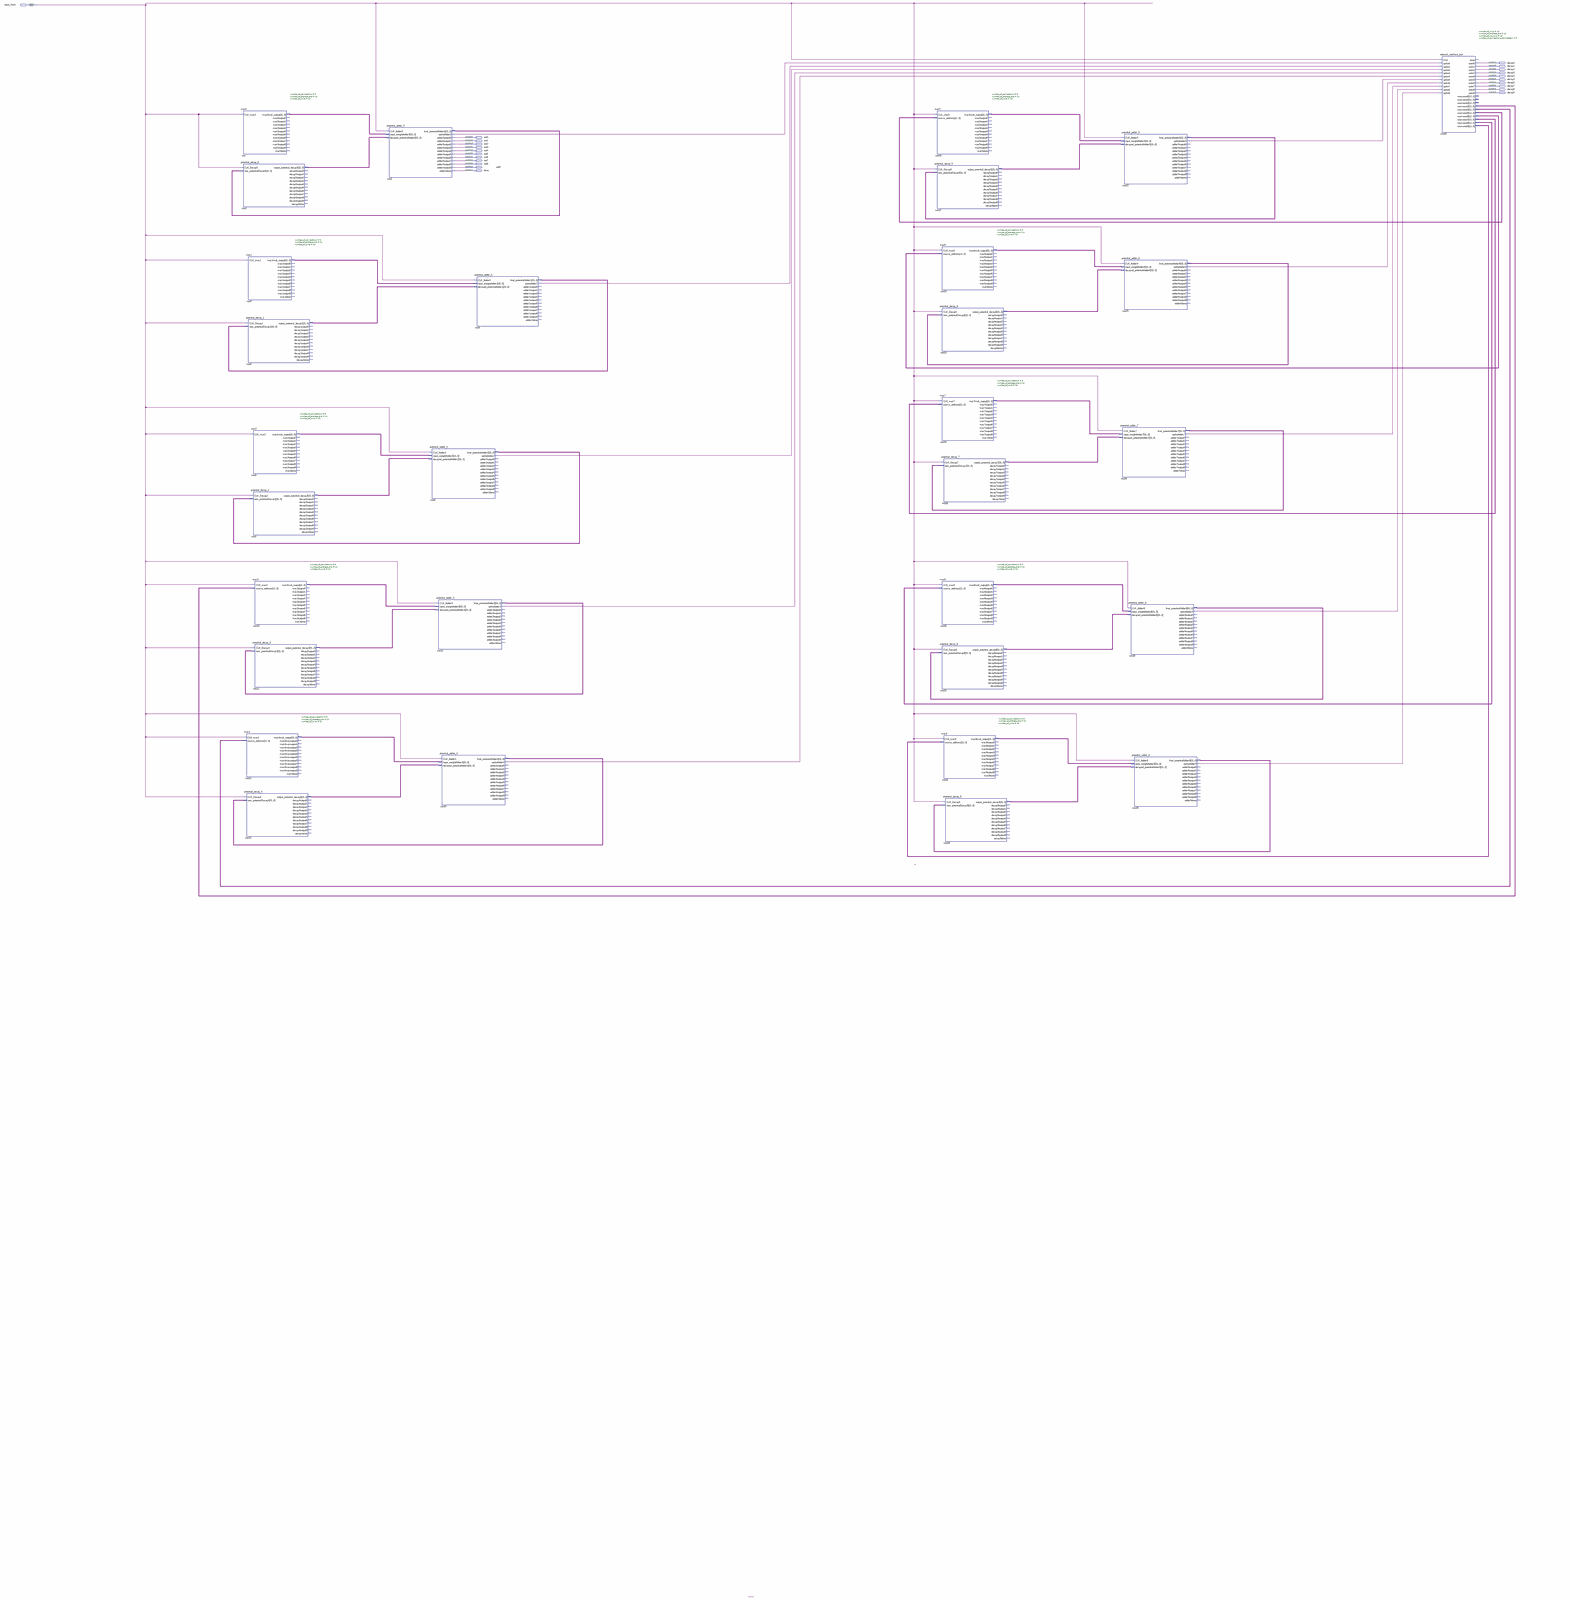
[diagram p0: schematic sheet, whole]
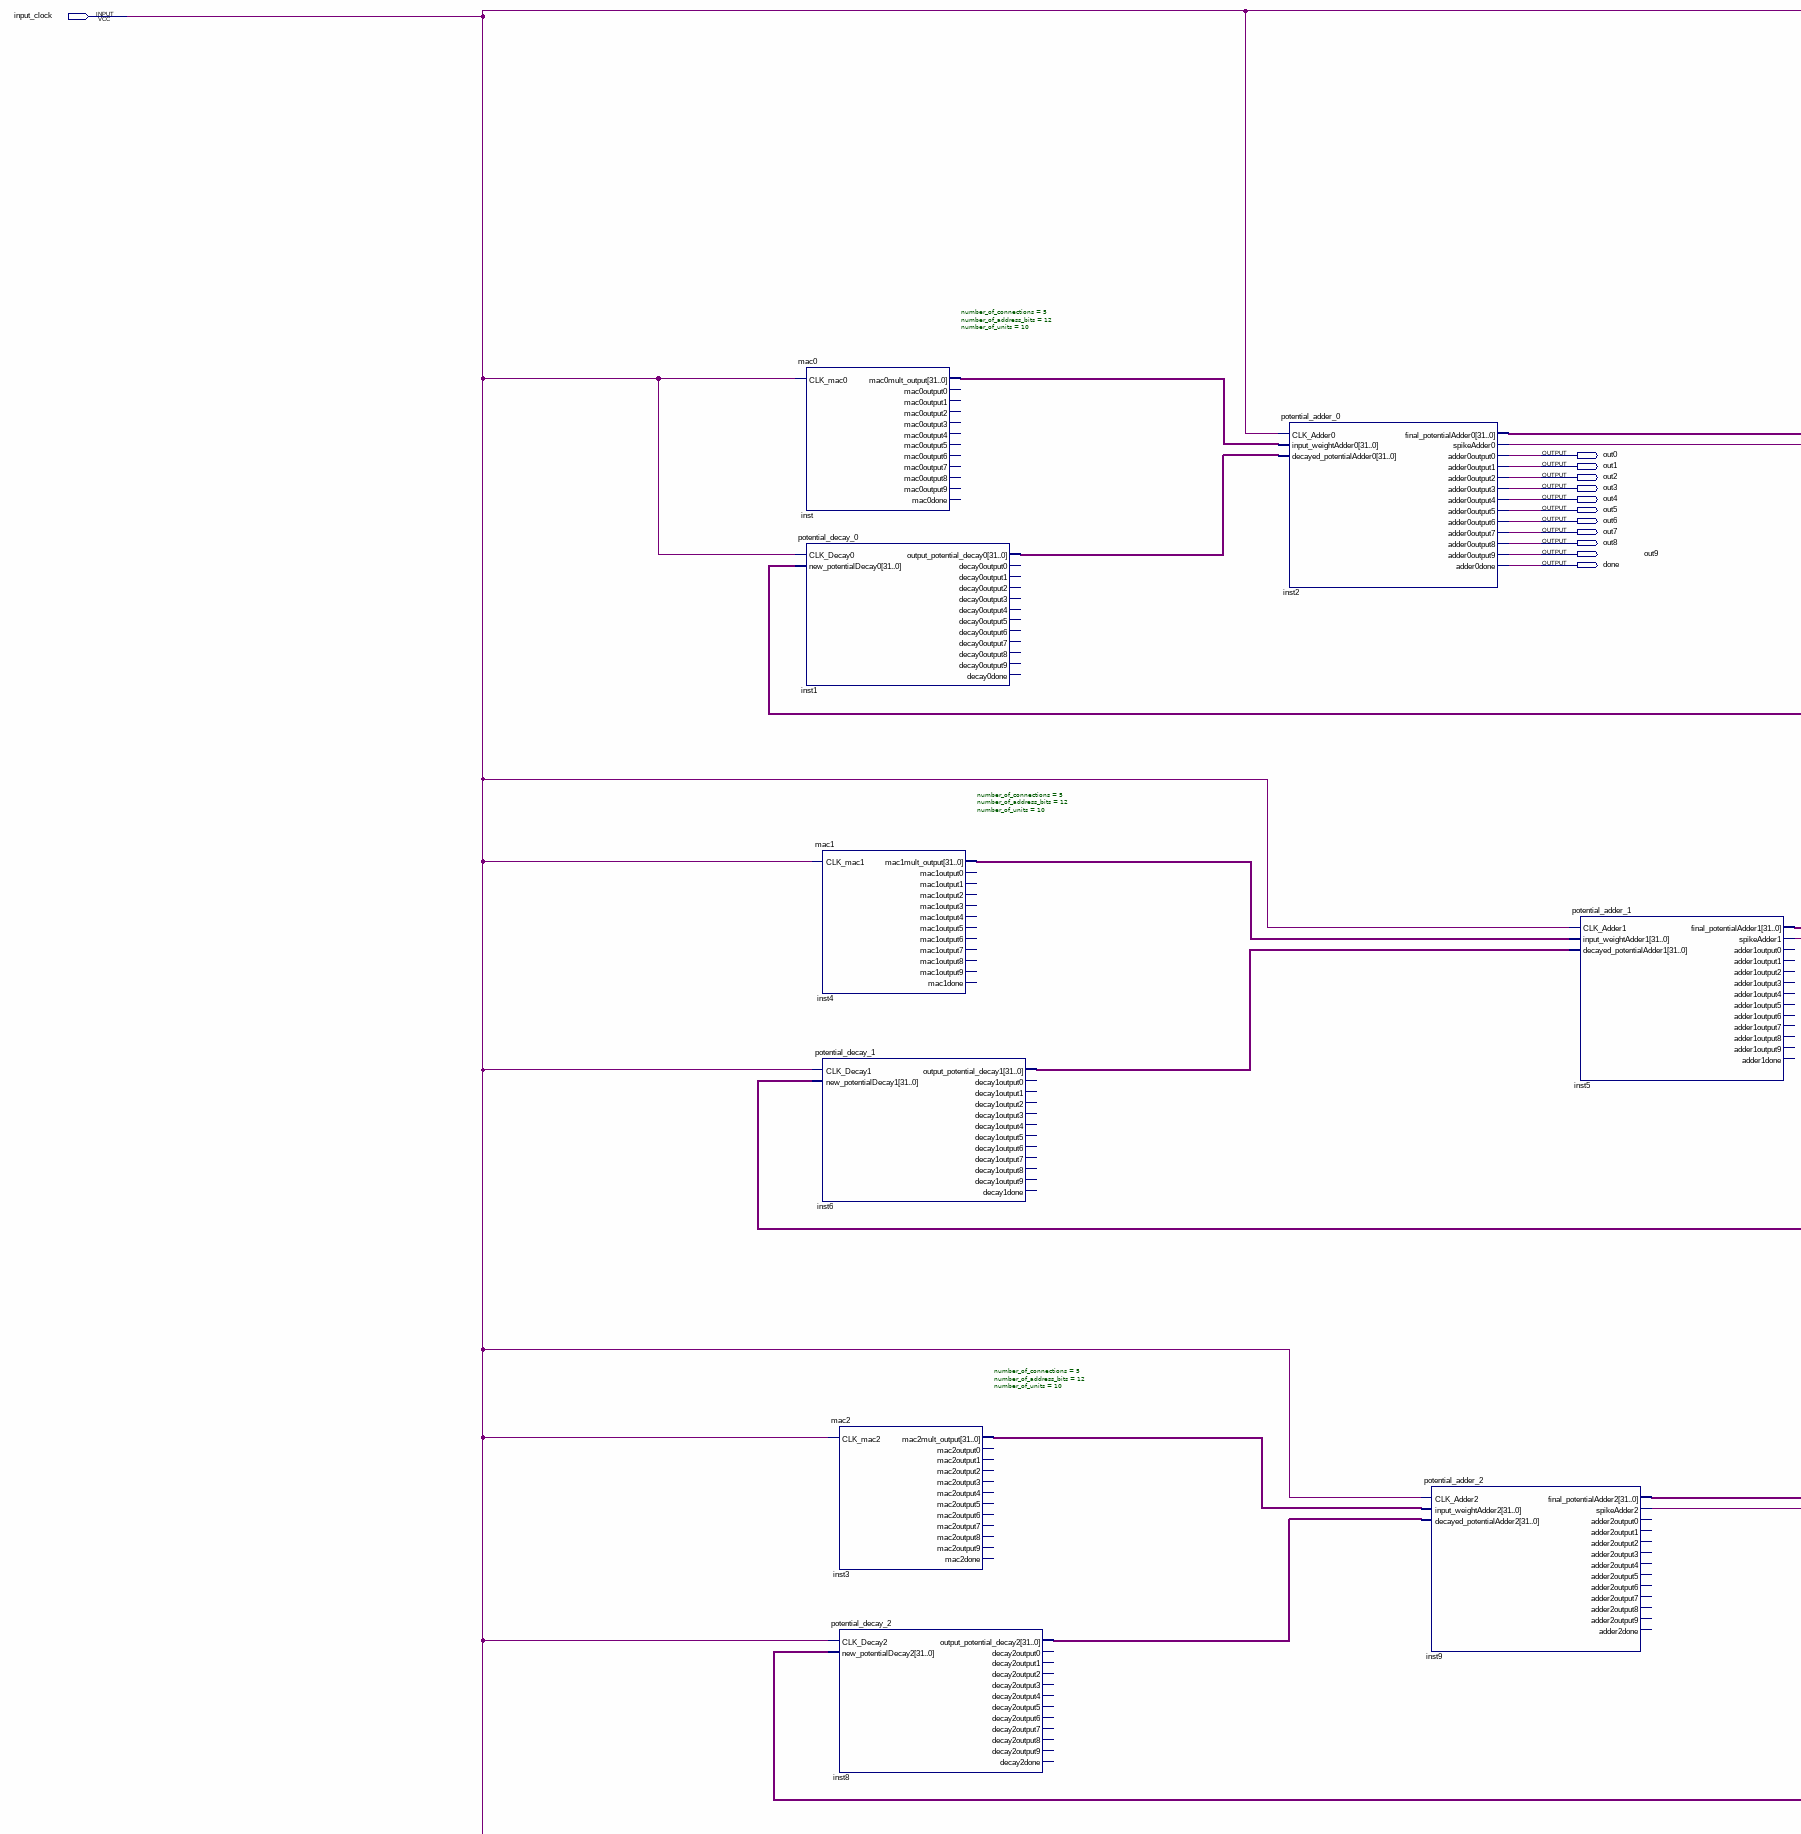
[diagram p1: schematic sheet, upper left part]
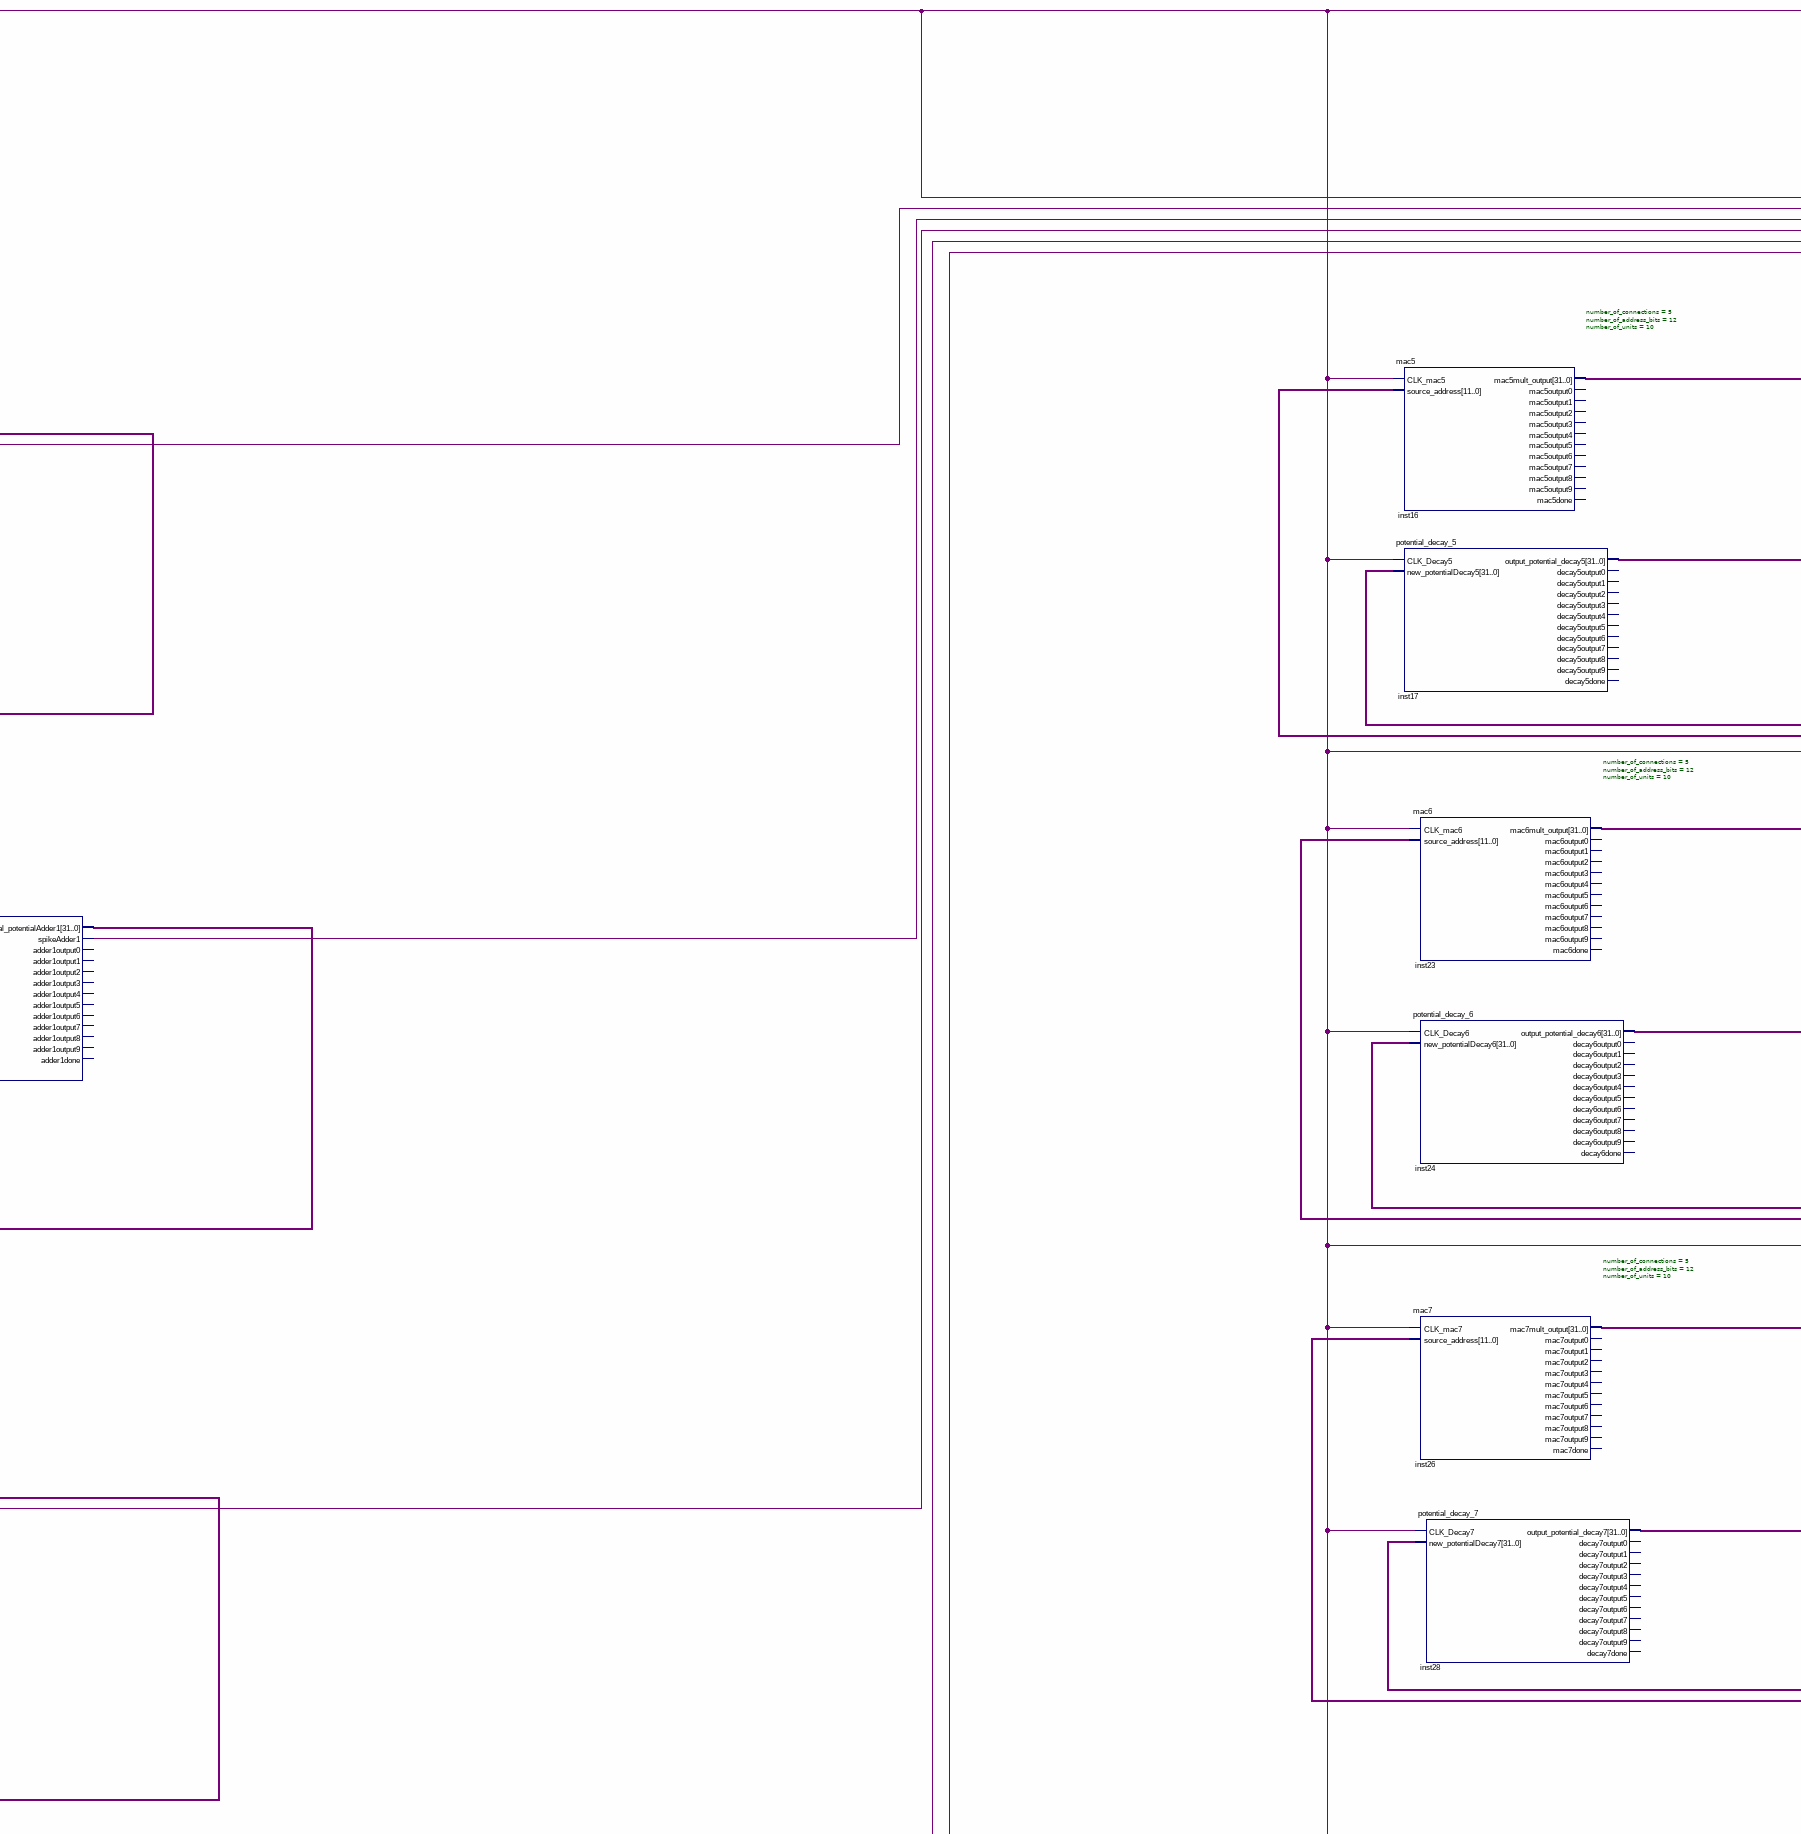
[diagram p2: schematic sheet, upper centre part]
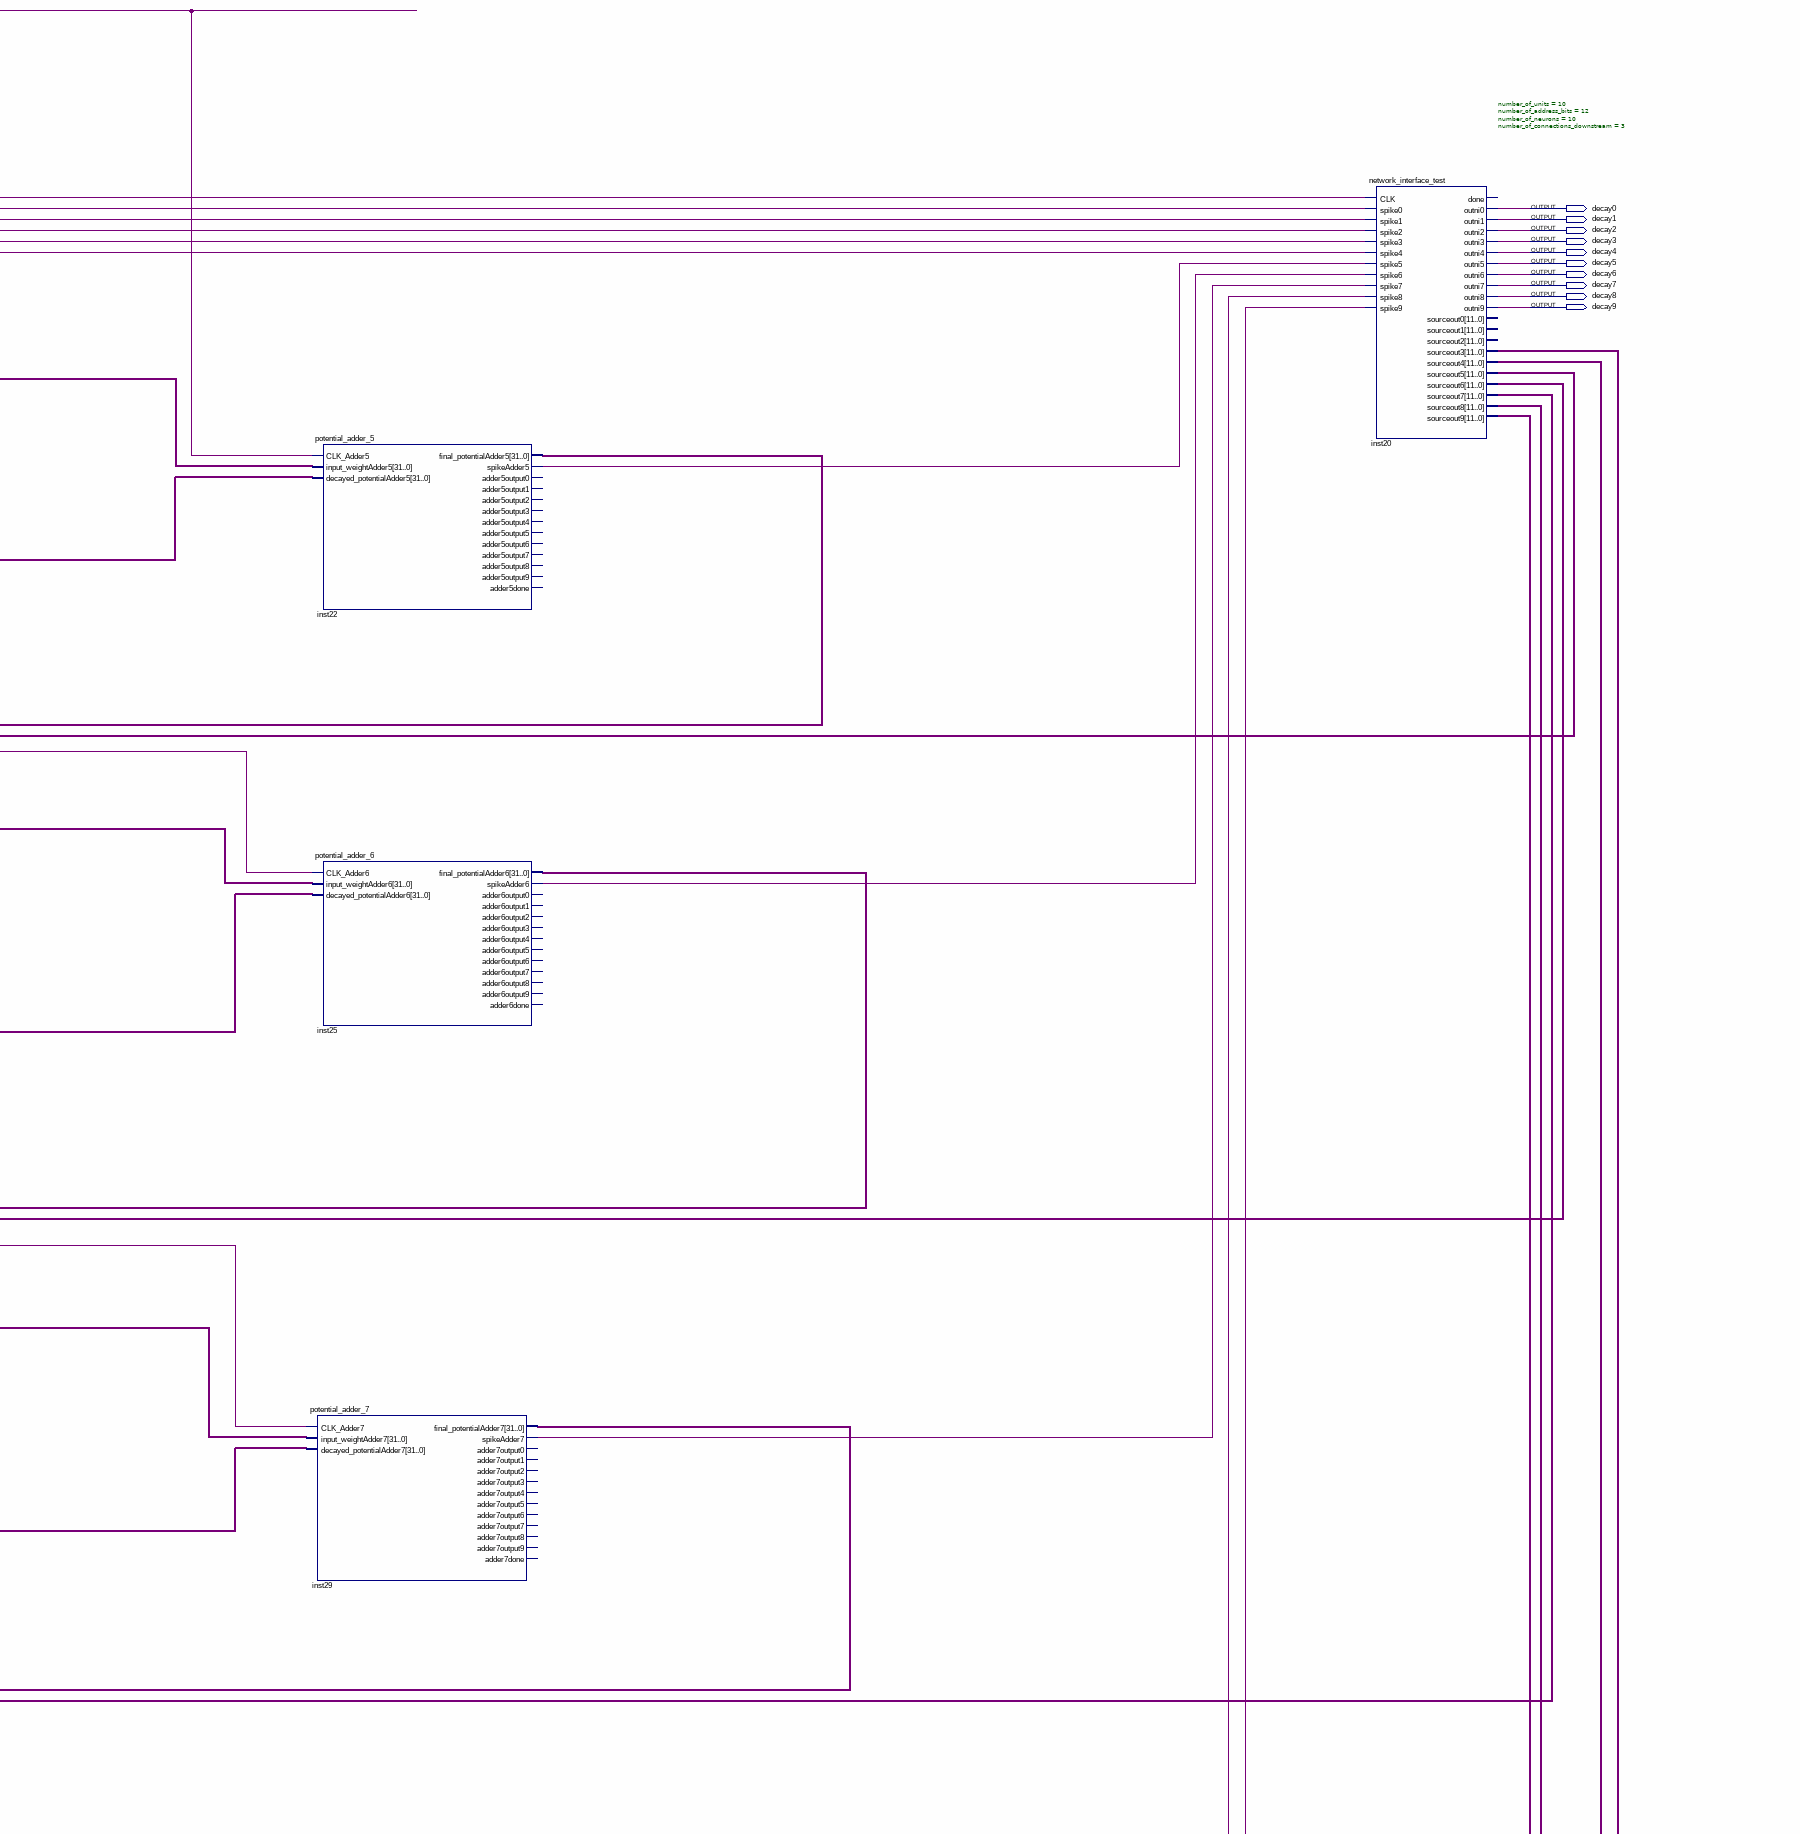
[diagram p3: schematic sheet, upper right part]
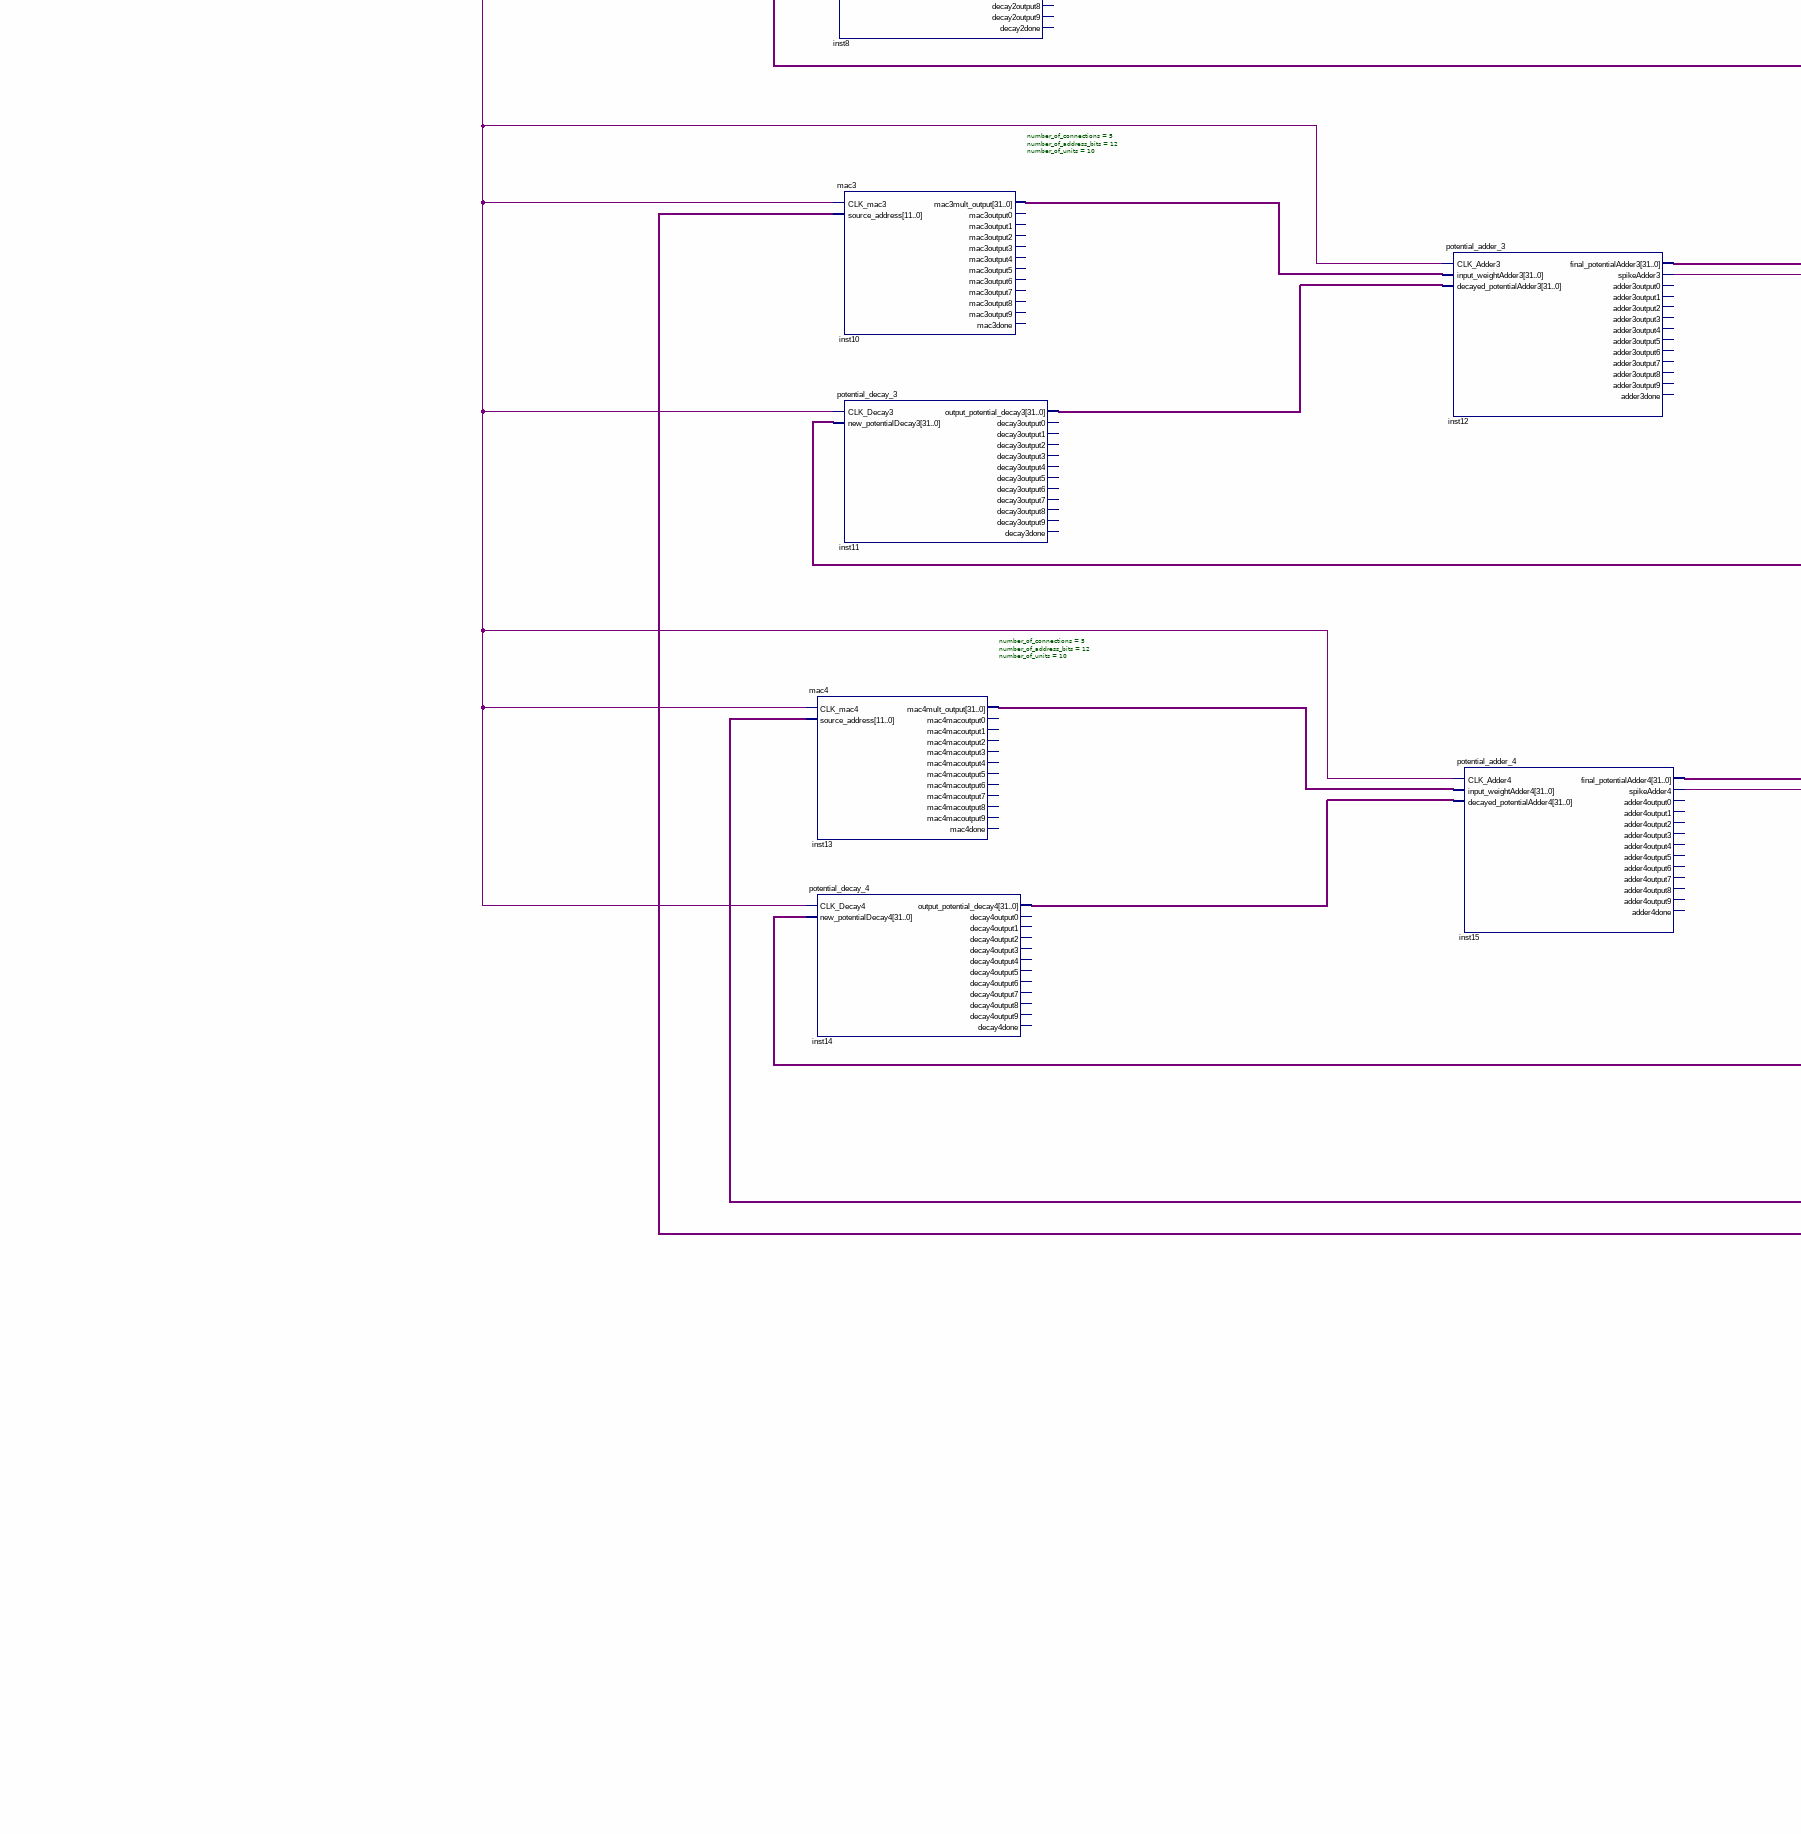
[diagram p4: schematic sheet, middle left part]
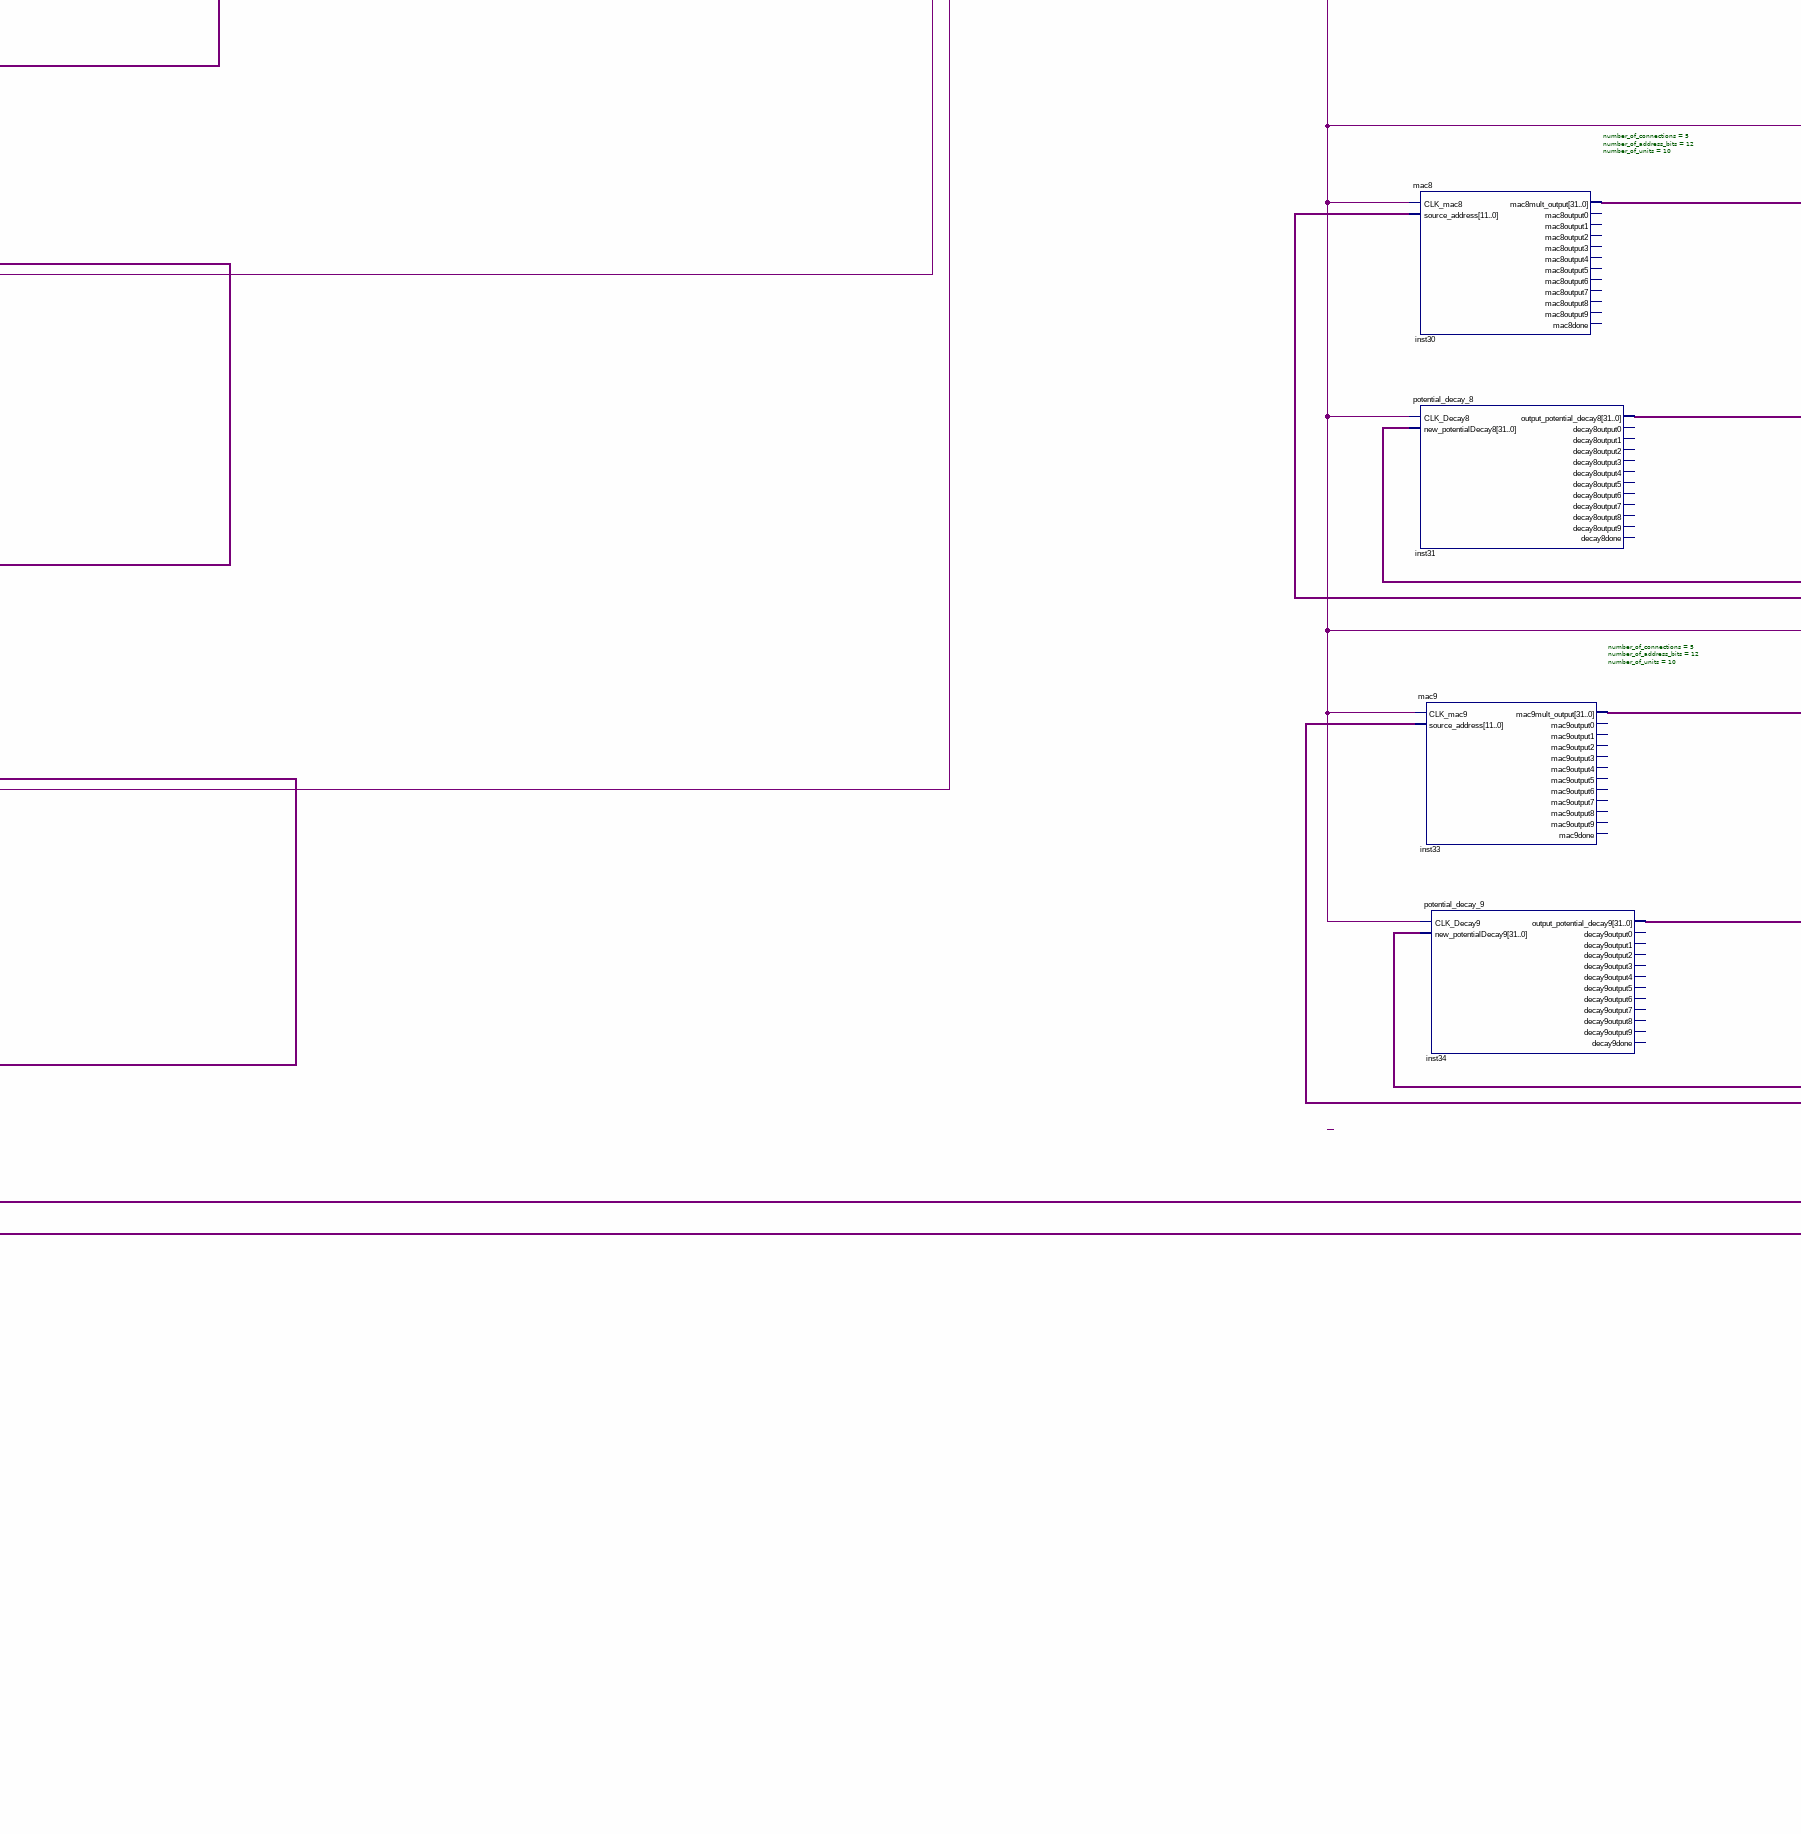
[diagram p5: schematic sheet, middle centre part]
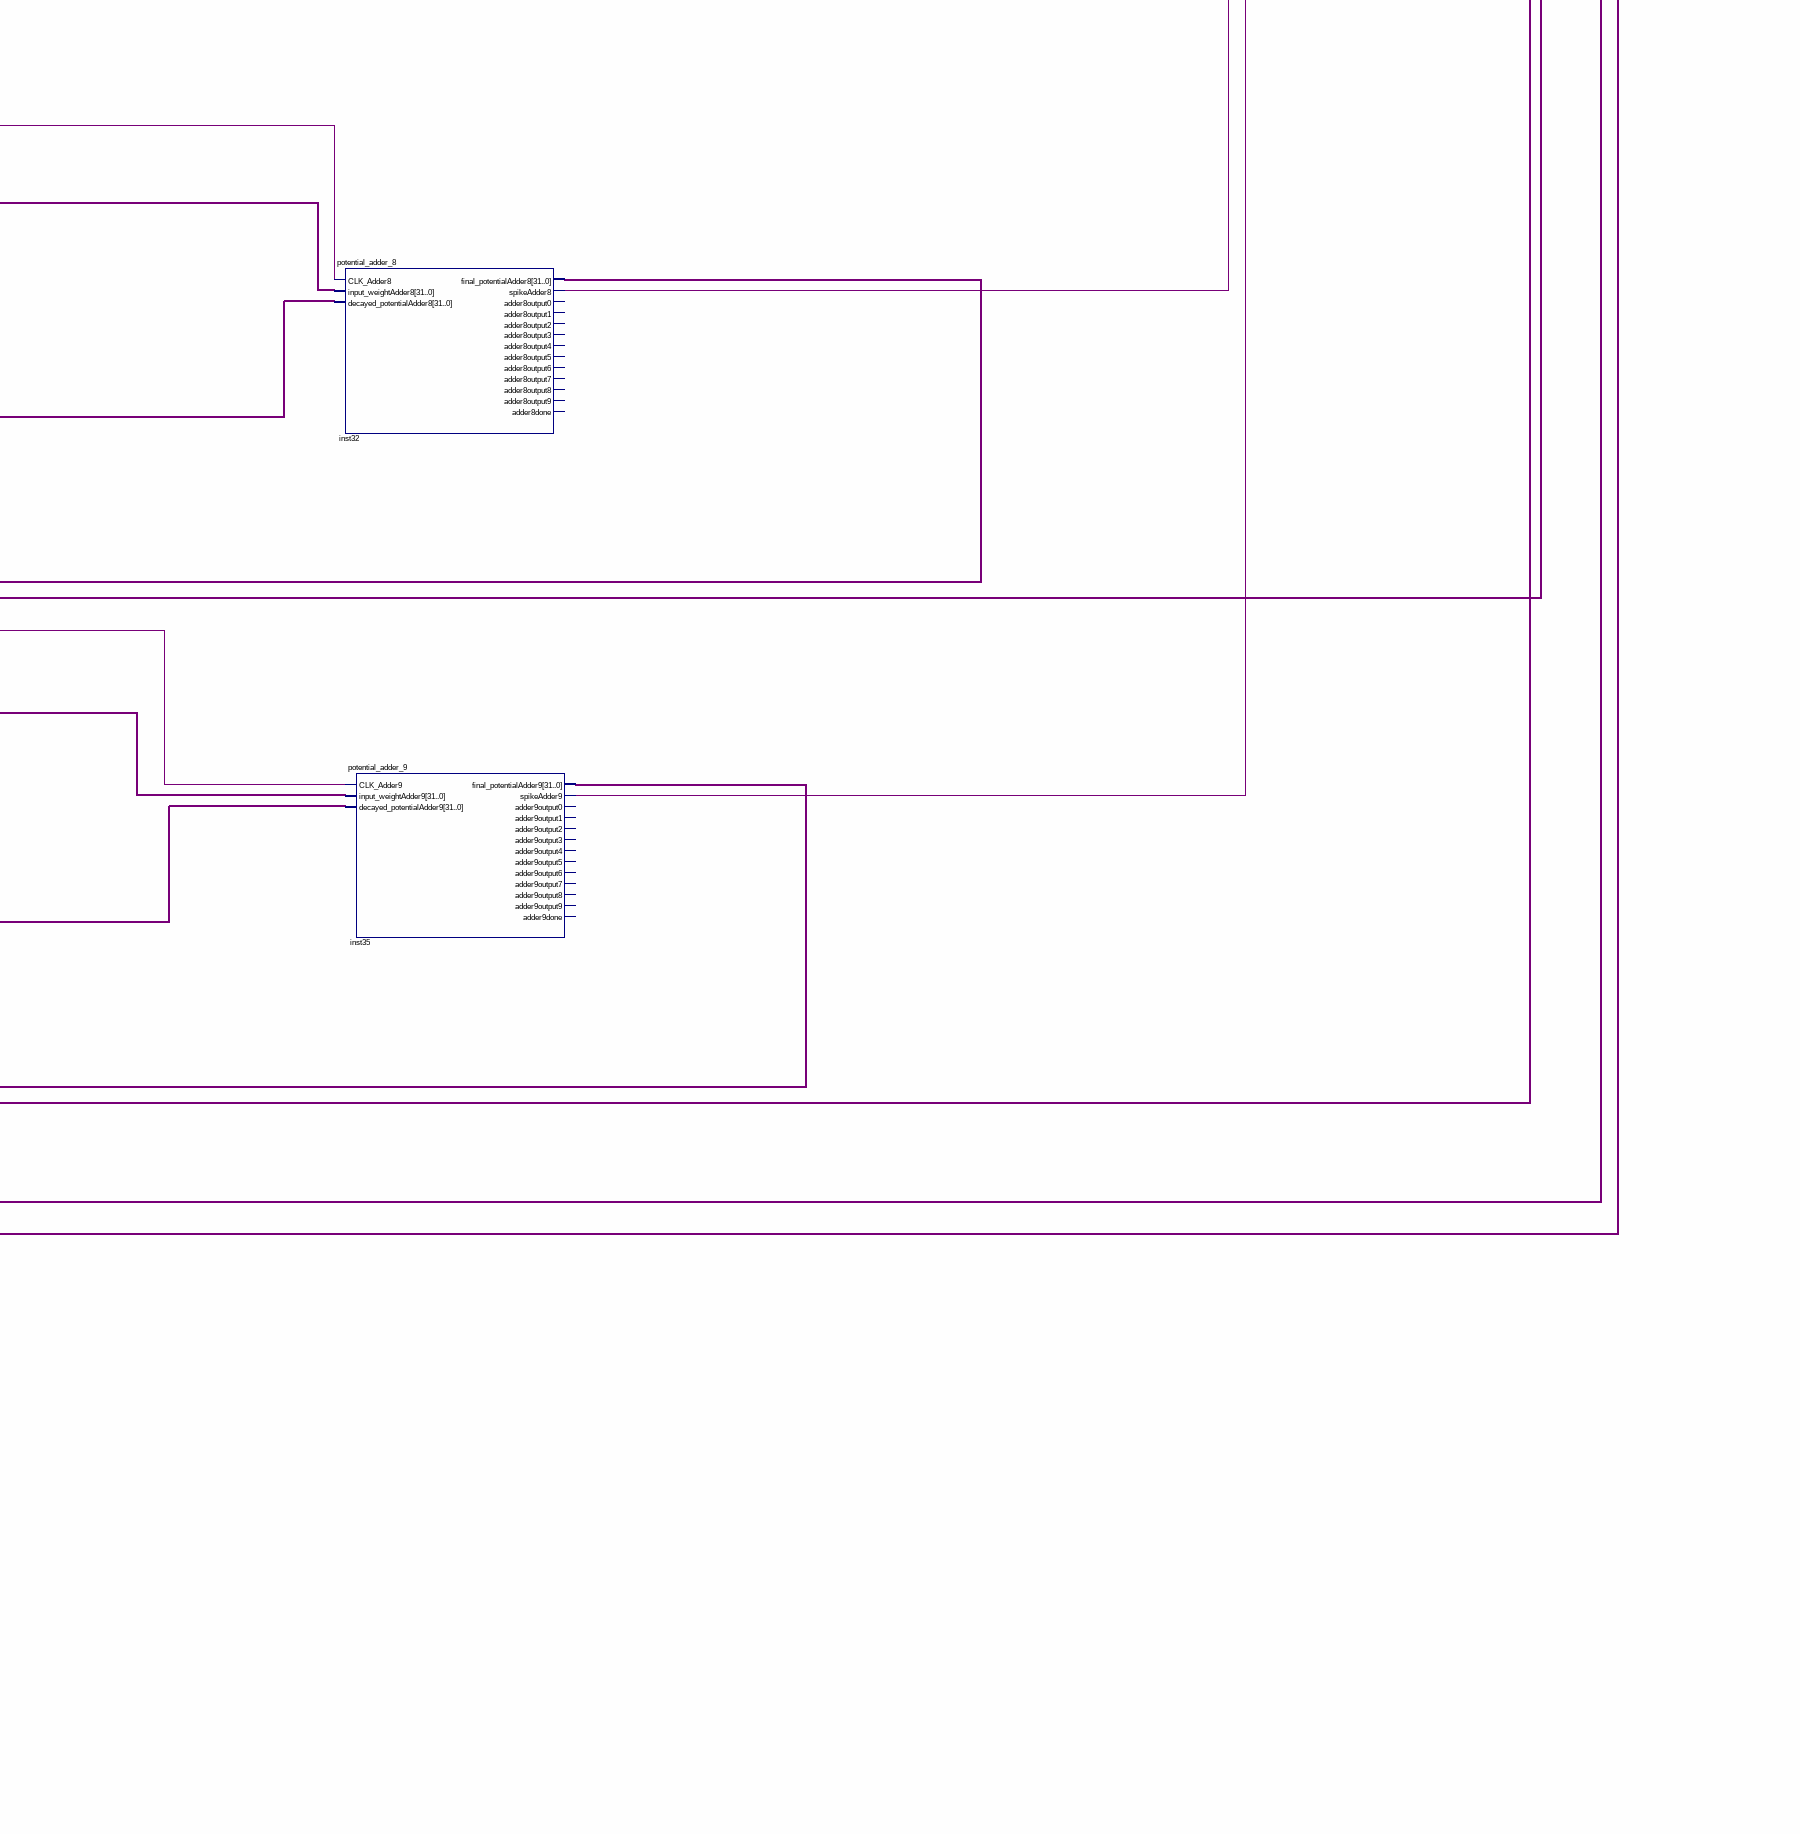
[diagram p6: schematic sheet, middle right part]
// Quartus schematic accelerator_toplevel.bdf as structural Verilog: 31 symbols, 22 pins
module accelerator_toplevel (
  input  input_clock,
  output decay0,
  output decay1,
  output decay2,
  output decay3,
  output decay4,
  output decay5,
  output decay6,
  output decay7,
  output decay8,
  output decay9,
  output out0,
  output out1,
  output out2,
  output out3,
  output out4,
  output out5,
  output out6,
  output out7,
  output out8,
  output out9,
  output done
);

  wire inst2_spikeadder0, inst5_spikeadder1, inst9_spikeadder2, inst12_spikeadder3, inst15_spikeadder4,
       inst22_spikeadder5, inst25_spikeadder6, inst29_spikeadder7, inst32_spikeadder8, inst35_spikeadder9;
  wire [11:0] inst20_sourceout3, inst20_sourceout4, inst20_sourceout5, inst20_sourceout6, inst20_sourceout7,
       inst20_sourceout8, inst20_sourceout9;
  wire [31:0] inst1_output_potential_decay0, inst2_final_potentialadder0, inst3_mac2mult_output,
       inst4_mac1mult_output, inst5_final_potentialadder1, inst6_output_potential_decay1,
       inst8_output_potential_decay2, inst9_final_potentialadder2, inst10_mac3mult_output,
       inst11_output_potential_decay3, inst12_final_potentialadder3, inst13_mac4mult_output,
       inst14_output_potential_decay4, inst15_final_potentialadder4, inst16_mac5mult_output,
       inst17_output_potential_decay5, inst22_final_potentialadder5, inst23_mac6mult_output,
       inst24_output_potential_decay6, inst25_final_potentialadder6, inst26_mac7mult_output,
       inst28_output_potential_decay7, inst29_final_potentialadder7, inst30_mac8mult_output,
       inst31_output_potential_decay8, inst32_final_potentialadder8, inst33_mac9mult_output,
       inst34_output_potential_decay9, inst35_final_potentialadder9, inst_mac0mult_output;

  mac0 #(.number_of_connections(5), .number_of_address_bits(12), .number_of_units(10)) inst (
    .CLK_mac0(input_clock), .mac0mult_output(inst_mac0mult_output));  // open: mac0output0, mac0output1, mac0output2, mac0output3, mac0output4, mac0output5, mac0output6, mac0output7, mac0output8, mac0output9, mac0done
  potential_decay_0 inst1 (
    .CLK_Decay0(input_clock), .new_potentialDecay0(inst2_final_potentialadder0),
    .output_potential_decay0(inst1_output_potential_decay0));  // open: decay0output0, decay0output1, decay0output2, decay0output3, decay0output4, decay0output5, decay0output6, decay0output7, decay0output8, decay0output9, decay0done
  mac1 #(.number_of_connections(5), .number_of_address_bits(12), .number_of_units(10)) inst4 (
    .CLK_mac1(input_clock), .mac1mult_output(inst4_mac1mult_output));  // open: mac1output0, mac1output1, mac1output2, mac1output3, mac1output4, mac1output5, mac1output6, mac1output7, mac1output8, mac1output9, mac1done
  potential_decay_1 inst6 (
    .CLK_Decay1(input_clock), .new_potentialDecay1(inst5_final_potentialadder1),
    .output_potential_decay1(inst6_output_potential_decay1));  // open: decay1output0, decay1output1, decay1output2, decay1output3, decay1output4, decay1output5, decay1output6, decay1output7, decay1output8, decay1output9, decay1done
  mac2 #(.number_of_connections(5), .number_of_address_bits(12), .number_of_units(10)) inst3 (
    .CLK_mac2(input_clock), .mac2mult_output(inst3_mac2mult_output));  // open: mac2output0, mac2output1, mac2output2, mac2output3, mac2output4, mac2output5, mac2output6, mac2output7, mac2output8, mac2output9, mac2done
  potential_decay_2 inst8 (
    .CLK_Decay2(input_clock), .new_potentialDecay2(inst9_final_potentialadder2),
    .output_potential_decay2(inst8_output_potential_decay2));  // open: decay2output0, decay2output1, decay2output2, decay2output3, decay2output4, decay2output5, decay2output6, decay2output7, decay2output8, decay2output9, decay2done
  mac3 #(.number_of_connections(5), .number_of_address_bits(12), .number_of_units(10)) inst10 (
    .CLK_mac3(input_clock), .source_address(inst20_sourceout3), .mac3mult_output(inst10_mac3mult_output));  // open: mac3output0, mac3output1, mac3output2, mac3output3, mac3output4, mac3output5, mac3output6, mac3output7, mac3output8, mac3output9, mac3done
  potential_decay_3 inst11 (
    .CLK_Decay3(input_clock), .new_potentialDecay3(inst12_final_potentialadder3),
    .output_potential_decay3(inst11_output_potential_decay3));  // open: decay3output0, decay3output1, decay3output2, decay3output3, decay3output4, decay3output5, decay3output6, decay3output7, decay3output8, decay3output9, decay3done
  mac4 #(.number_of_connections(5), .number_of_address_bits(12), .number_of_units(10)) inst13 (
    .CLK_mac4(input_clock), .source_address(inst20_sourceout4), .mac4mult_output(inst13_mac4mult_output));  // open: mac4macoutput0, mac4macoutput1, mac4macoutput2, mac4macoutput3, mac4macoutput4, mac4macoutput5, mac4macoutput6, mac4macoutput7, mac4macoutput8, mac4macoutput9, mac4done
  potential_decay_4 inst14 (
    .CLK_Decay4(input_clock), .new_potentialDecay4(inst15_final_potentialadder4),
    .output_potential_decay4(inst14_output_potential_decay4));  // open: decay4output0, decay4output1, decay4output2, decay4output3, decay4output4, decay4output5, decay4output6, decay4output7, decay4output8, decay4output9, decay4done
  potential_adder_0 inst2 (
    .CLK_Adder0(input_clock), .input_weightAdder0(inst_mac0mult_output),
    .decayed_potentialAdder0(inst1_output_potential_decay0),
    .final_potentialAdder0(inst2_final_potentialadder0), .spikeAdder0(inst2_spikeadder0),
    .adder0output0(out0), .adder0output1(out1), .adder0output2(out2), .adder0output3(out3),
    .adder0output4(out4), .adder0output5(out5), .adder0output6(out6), .adder0output7(out7),
    .adder0output8(out8), .adder0output9(out9), .adder0done(done));
  potential_adder_2 inst9 (
    .CLK_Adder2(input_clock), .input_weightAdder2(inst3_mac2mult_output),
    .decayed_potentialAdder2(inst8_output_potential_decay2),
    .final_potentialAdder2(inst9_final_potentialadder2), .spikeAdder2(inst9_spikeadder2));  // open: adder2output0, adder2output1, adder2output2, adder2output3, adder2output4, adder2output5, adder2output6, adder2output7, adder2output8, adder2output9, adder2done
  potential_adder_3 inst12 (
    .CLK_Adder3(input_clock), .input_weightAdder3(inst10_mac3mult_output),
    .decayed_potentialAdder3(inst11_output_potential_decay3),
    .final_potentialAdder3(inst12_final_potentialadder3), .spikeAdder3(inst12_spikeadder3));  // open: adder3output0, adder3output1, adder3output2, adder3output3, adder3output4, adder3output5, adder3output6, adder3output7, adder3output8, adder3output9, adder3done
  potential_adder_4 inst15 (
    .CLK_Adder4(input_clock), .input_weightAdder4(inst13_mac4mult_output),
    .decayed_potentialAdder4(inst14_output_potential_decay4),
    .final_potentialAdder4(inst15_final_potentialadder4), .spikeAdder4(inst15_spikeadder4));  // open: adder4output0, adder4output1, adder4output2, adder4output3, adder4output4, adder4output5, adder4output6, adder4output7, adder4output8, adder4output9, adder4done
  potential_adder_1 inst5 (
    .CLK_Adder1(input_clock), .input_weightAdder1(inst4_mac1mult_output),
    .decayed_potentialAdder1(inst6_output_potential_decay1),
    .final_potentialAdder1(inst5_final_potentialadder1), .spikeAdder1(inst5_spikeadder1));  // open: adder1output0, adder1output1, adder1output2, adder1output3, adder1output4, adder1output5, adder1output6, adder1output7, adder1output8, adder1output9, adder1done
  mac5 #(.number_of_connections(5), .number_of_address_bits(12), .number_of_units(10)) inst16 (
    .CLK_mac5(input_clock), .source_address(inst20_sourceout5), .mac5mult_output(inst16_mac5mult_output));  // open: mac5output0, mac5output1, mac5output2, mac5output3, mac5output4, mac5output5, mac5output6, mac5output7, mac5output8, mac5output9, mac5done
  potential_decay_5 inst17 (
    .CLK_Decay5(input_clock), .new_potentialDecay5(inst22_final_potentialadder5),
    .output_potential_decay5(inst17_output_potential_decay5));  // open: decay5output0, decay5output1, decay5output2, decay5output3, decay5output4, decay5output5, decay5output6, decay5output7, decay5output8, decay5output9, decay5done
  mac6 #(.number_of_connections(5), .number_of_address_bits(12), .number_of_units(10)) inst23 (
    .CLK_mac6(input_clock), .source_address(inst20_sourceout6), .mac6mult_output(inst23_mac6mult_output));  // open: mac6output0, mac6output1, mac6output2, mac6output3, mac6output4, mac6output5, mac6output6, mac6output7, mac6output8, mac6output9, mac6done
  potential_decay_6 inst24 (
    .CLK_Decay6(input_clock), .new_potentialDecay6(inst25_final_potentialadder6),
    .output_potential_decay6(inst24_output_potential_decay6));  // open: decay6output0, decay6output1, decay6output2, decay6output3, decay6output4, decay6output5, decay6output6, decay6output7, decay6output8, decay6output9, decay6done
  mac7 #(.number_of_connections(5), .number_of_address_bits(12), .number_of_units(10)) inst26 (
    .CLK_mac7(input_clock), .source_address(inst20_sourceout7), .mac7mult_output(inst26_mac7mult_output));  // open: mac7output0, mac7output1, mac7output2, mac7output3, mac7output4, mac7output5, mac7output6, mac7output7, mac7output8, mac7output9, mac7done
  potential_decay_7 inst28 (
    .CLK_Decay7(input_clock), .new_potentialDecay7(inst29_final_potentialadder7),
    .output_potential_decay7(inst28_output_potential_decay7));  // open: decay7output0, decay7output1, decay7output2, decay7output3, decay7output4, decay7output5, decay7output6, decay7output7, decay7output8, decay7output9, decay7done
  mac8 #(.number_of_connections(5), .number_of_address_bits(12), .number_of_units(10)) inst30 (
    .CLK_mac8(input_clock), .source_address(inst20_sourceout8), .mac8mult_output(inst30_mac8mult_output));  // open: mac8output0, mac8output1, mac8output2, mac8output3, mac8output4, mac8output5, mac8output6, mac8output7, mac8output8, mac8output9, mac8done
  potential_decay_8 inst31 (
    .CLK_Decay8(input_clock), .new_potentialDecay8(inst32_final_potentialadder8),
    .output_potential_decay8(inst31_output_potential_decay8));  // open: decay8output0, decay8output1, decay8output2, decay8output3, decay8output4, decay8output5, decay8output6, decay8output7, decay8output8, decay8output9, decay8done
  mac9 #(.number_of_connections(5), .number_of_address_bits(12), .number_of_units(10)) inst33 (
    .CLK_mac9(input_clock), .source_address(inst20_sourceout9), .mac9mult_output(inst33_mac9mult_output));  // open: mac9output0, mac9output1, mac9output2, mac9output3, mac9output4, mac9output5, mac9output6, mac9output7, mac9output8, mac9output9, mac9done
  potential_decay_9 inst34 (
    .CLK_Decay9(input_clock), .new_potentialDecay9(inst35_final_potentialadder9),
    .output_potential_decay9(inst34_output_potential_decay9));  // open: decay9output0, decay9output1, decay9output2, decay9output3, decay9output4, decay9output5, decay9output6, decay9output7, decay9output8, decay9output9, decay9done
  potential_adder_5 inst22 (
    .CLK_Adder5(input_clock), .input_weightAdder5(inst16_mac5mult_output),
    .decayed_potentialAdder5(inst17_output_potential_decay5),
    .final_potentialAdder5(inst22_final_potentialadder5), .spikeAdder5(inst22_spikeadder5));  // open: adder5output0, adder5output1, adder5output2, adder5output3, adder5output4, adder5output5, adder5output6, adder5output7, adder5output8, adder5output9, adder5done
  potential_adder_6 inst25 (
    .CLK_Adder6(input_clock), .input_weightAdder6(inst23_mac6mult_output),
    .decayed_potentialAdder6(inst24_output_potential_decay6),
    .final_potentialAdder6(inst25_final_potentialadder6), .spikeAdder6(inst25_spikeadder6));  // open: adder6output0, adder6output1, adder6output2, adder6output3, adder6output4, adder6output5, adder6output6, adder6output7, adder6output8, adder6output9, adder6done
  potential_adder_7 inst29 (
    .CLK_Adder7(input_clock), .input_weightAdder7(inst26_mac7mult_output),
    .decayed_potentialAdder7(inst28_output_potential_decay7),
    .final_potentialAdder7(inst29_final_potentialadder7), .spikeAdder7(inst29_spikeadder7));  // open: adder7output0, adder7output1, adder7output2, adder7output3, adder7output4, adder7output5, adder7output6, adder7output7, adder7output8, adder7output9, adder7done
  potential_adder_8 inst32 (
    .CLK_Adder8(input_clock), .input_weightAdder8(inst30_mac8mult_output),
    .decayed_potentialAdder8(inst31_output_potential_decay8),
    .final_potentialAdder8(inst32_final_potentialadder8), .spikeAdder8(inst32_spikeadder8));  // open: adder8output0, adder8output1, adder8output2, adder8output3, adder8output4, adder8output5, adder8output6, adder8output7, adder8output8, adder8output9, adder8done
  potential_adder_9 inst35 (
    .CLK_Adder9(input_clock), .input_weightAdder9(inst33_mac9mult_output),
    .decayed_potentialAdder9(inst34_output_potential_decay9),
    .final_potentialAdder9(inst35_final_potentialadder9), .spikeAdder9(inst35_spikeadder9));  // open: adder9output0, adder9output1, adder9output2, adder9output3, adder9output4, adder9output5, adder9output6, adder9output7, adder9output8, adder9output9, adder9done
  network_interface_test #(.number_of_units(10), .number_of_address_bits(12), .number_of_neurons(10), .number_of_connections_downstream(3)) inst20 (
    .CLK(input_clock), .spike0(inst2_spikeadder0), .spike1(inst5_spikeadder1), .spike2(inst9_spikeadder2),
    .spike3(inst12_spikeadder3), .spike4(inst15_spikeadder4), .spike5(inst22_spikeadder5),
    .spike6(inst25_spikeadder6), .spike7(inst29_spikeadder7), .spike8(inst32_spikeadder8),
    .spike9(inst35_spikeadder9), .outni0(decay0), .outni1(decay1), .outni2(decay2), .outni3(decay3),
    .outni4(decay4), .outni5(decay5), .outni6(decay6), .outni7(decay7), .outni8(decay8), .outni9(decay9),
    .sourceout3(inst20_sourceout3), .sourceout4(inst20_sourceout4), .sourceout5(inst20_sourceout5),
    .sourceout6(inst20_sourceout6), .sourceout7(inst20_sourceout7), .sourceout8(inst20_sourceout8),
    .sourceout9(inst20_sourceout9));  // open: done, sourceout0, sourceout1, sourceout2
endmodule
